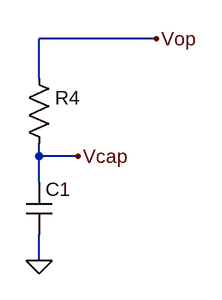
[diagram p0: schematic timing.asc]
timing.asc, the LTspice schematic file:
Version 4
SHEET 1 880 680
WIRE 208 16 64 16
WIRE 64 64 64 16
WIRE 64 160 64 144
WIRE 112 160 64 160
WIRE 64 192 64 160
WIRE 64 288 64 256
FLAG 208 16 Vop
FLAG 64 288 0
FLAG 112 160 Vcap
SYMBOL res 48 48 R0
SYMATTR InstName R4
SYMATTR Value ""
SYMBOL cap 48 192 R0
SYMATTR InstName C1
SYMATTR Value ""

The netlist it stands for:
* timing.asc
R4 Vop Vcap
C1 Vcap 0
.backanno
.end